# EAGLE design dr_amged (EAGLE 7.7.0)
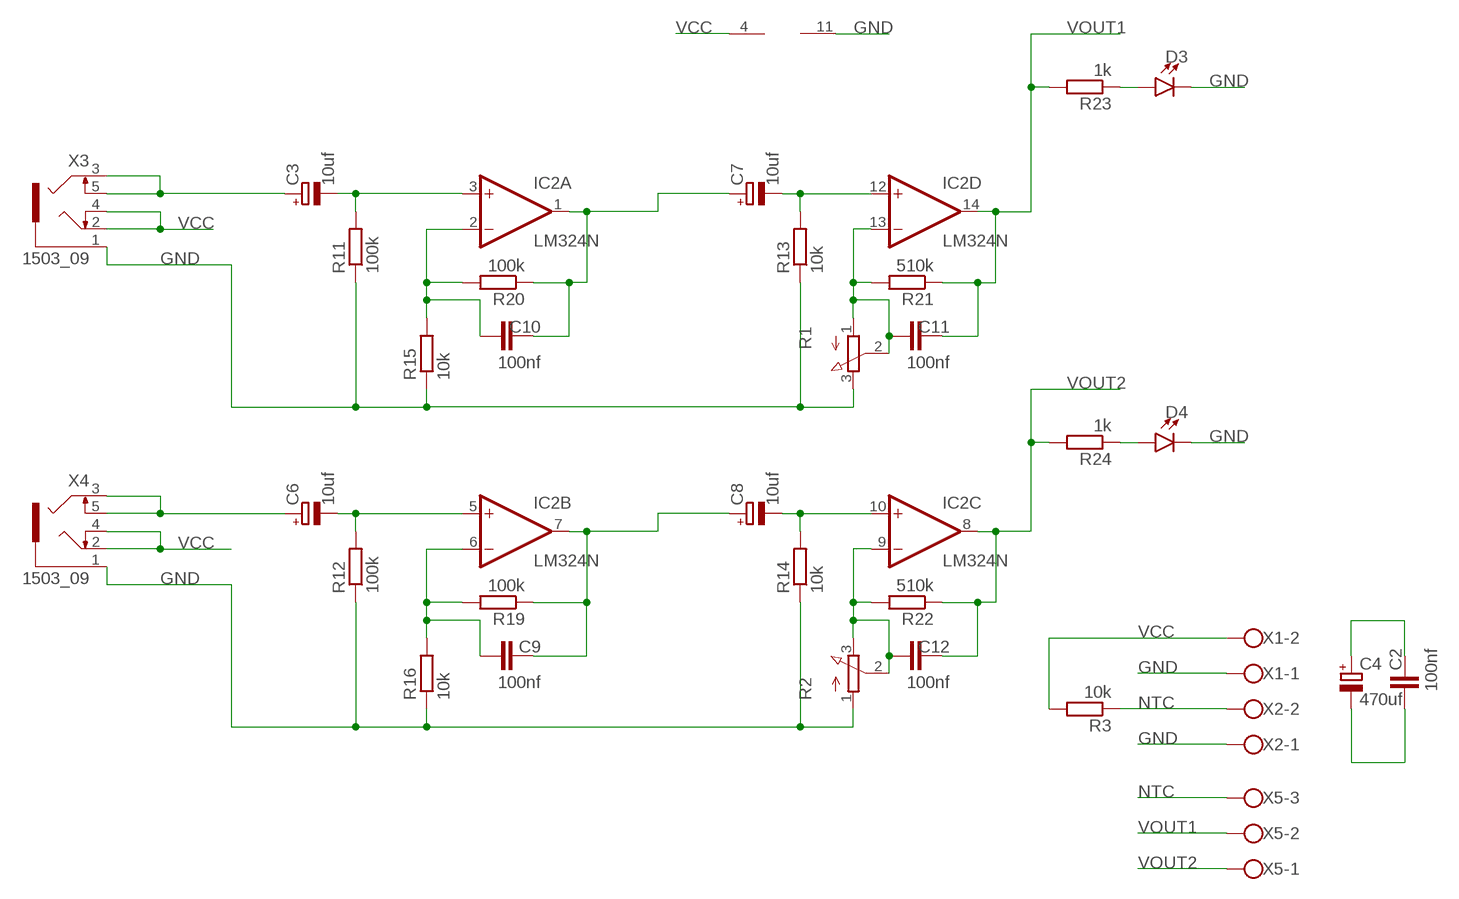
[diagram p0: schematic, sheet 1]

## Parts
C2  100nf  C-EU050-030X075  [C050-030X075]
C3  10uf  CPOL-EUE2-5  [E2-5]
C4  470uf  CPOL-EUE3.5-8  [E3,5-8]
C6  10uf  CPOL-EUE2-5  [E2-5]
C7  10uf  CPOL-EUE2-5  [E2-5]
C8  10uf  CPOL-EUE2-5  [E2-5]
C9  100nf  C-EU050-030X075  [C050-030X075]
C10  100nf  C-EU050-030X075  [C050-030X075]
C11  100nf  C-EU050-030X075  [C050-030X075]
C12  100nf  C-EU050-030X075  [C050-030X075]
D3  LED5MM  [LED_5MM]
D4  LED5MM  [LED_5MM]
IC2  LM324N  [DIL14]
R1  3RP/1610N  [3RP/1610N]
R2  3RP/1610N  [3RP/1610N]
R3  10k  R-EU_0207/10  [0207/10]
R11  100k  R-EU_0207/10  [0207/10]
R12  100k  R-EU_0207/10  [0207/10]
R13  10k  R-EU_0207/10  [0207/10]
R14  10k  R-EU_0207/10  [0207/10]
R15  10k  R-EU_0207/10  [0207/10]
R16  10k  R-EU_0207/10  [0207/10]
R19  100k  R-EU_0207/10  [0207/10]
R20  100k  R-EU_0207/10  [0207/10]
R21  510k  R-EU_0207/10  [0207/10]
R22  510k  R-EU_0207/10  [0207/10]
R23  1k  R-EU_0207/10  [0207/10]
R24  1k  R-EU_0207/10  [0207/10]
X1  W237-102  [W237-102]
X2  W237-102  [W237-102]
X3  1503_09  [1503_09]
X4  1503_09  [1503_09]
X5  W237-103  [W237-103]

## Nets
GND: C2.1 C4.- D3.K(C) D4.K(C) IC2.11(P:V-) R1.3(E) R2.1(A) R11.1 R12.1 R13.1 R14.1 R15.1 R16.1 X1.1 X2.1 X3.1 X4.1
N$4: C8.+ C9.2 IC2.7(B:OUT) R19.1
N$9: C9.1 IC2.6(B:-IN) R16.2 R19.2
N$12: C7.+ C10.2 IC2.1(A:OUT) R20.1
N$13: C10.1 IC2.2(A:-IN) R15.2 R20.2
N$15: C11.1 IC2.13(D:-IN) R1.1(A) R1.2(S) R21.2
N$17: C12.1 IC2.9(C:-IN) R2.2(S) R2.3(E) R22.2
N$18: C6.+ X4.3 X4.5
N$23: C3.+ X3.3 X3.5
N$24: C6.- IC2.5(B:+IN) R12.2
N$26: C7.- IC2.12(D:+IN) R13.2
N$28: C8.- IC2.10(C:+IN) R14.2
N$35: C3.- IC2.3(A:+IN) R11.2
N$36: D3.A R23.1
N$37: D4.A R24.1
NTC: R3.1 X2.2 X5.3
VCC: C2.2 C4.+ IC2.4(P:V+) R3.2 X1.2 X3.2 X3.4 X4.2 X4.4
VOUT1: C11.2 IC2.14(D:OUT) R21.1 R23.2 X5.2
VOUT2: C12.2 IC2.8(C:OUT) R22.1 R24.2 X5.1

## Library data of the parts
C2 C9-C12 = rcl:C-EU: CAPACITOR, European symbol; SPICEPREFIX: C
C3 C4 C6-C8 = rcl:CPOL-EU: POLARIZED CAPACITOR, European symbol; SPICEPREFIX: C
D3 D4 = SparkFun-LED:LED: LED (Generic) Standard schematic elements and footprints for 5mm, 3mm, 1206, and 0603 sized LEDs. Generic LEDs with no color specified.
IC2 = linear:LM324: OP AMP
R1 R2 = pot:3RP/1610N: 16mm Potentiometer one level Source: http://www.alphapotentiometers.net/html/16mm_pot_2.html
R3 R11-R16 R19-R24 = rcl:R-EU_: RESISTOR, European symbol; SPICEPREFIX: R
X1 X2 = con-wago-500:W237-102: WAGO SCREW CLAMP; MPN: 237-102; OC_FARNELL: unknown; OC_NEWARK: 70K9898
X3 X4 = con-lumberg:1503_09: Jack connectors according to JISC 6560, 3.5 mm Klinkeneinbaukupplung nach JISC 6560, 3,5 mm, 3-polig/ stereo, abgewinkelte Ausführung, mit 2 Öffnern und Lötaugen, für Leiterplatten Rückseitenmontage Source: http://www.lumberg.com/Produkte/PDFs/1503_09.pdf; OC_FARNELL: 1243244; OC_NEWARK: unknown
X5 = con-wago-500@1:W237-103: WAGO SCREW CLAMP; MPN: 237-103; OC_FARNELL: unknown; OC_NEWARK: 18M7116

## Board
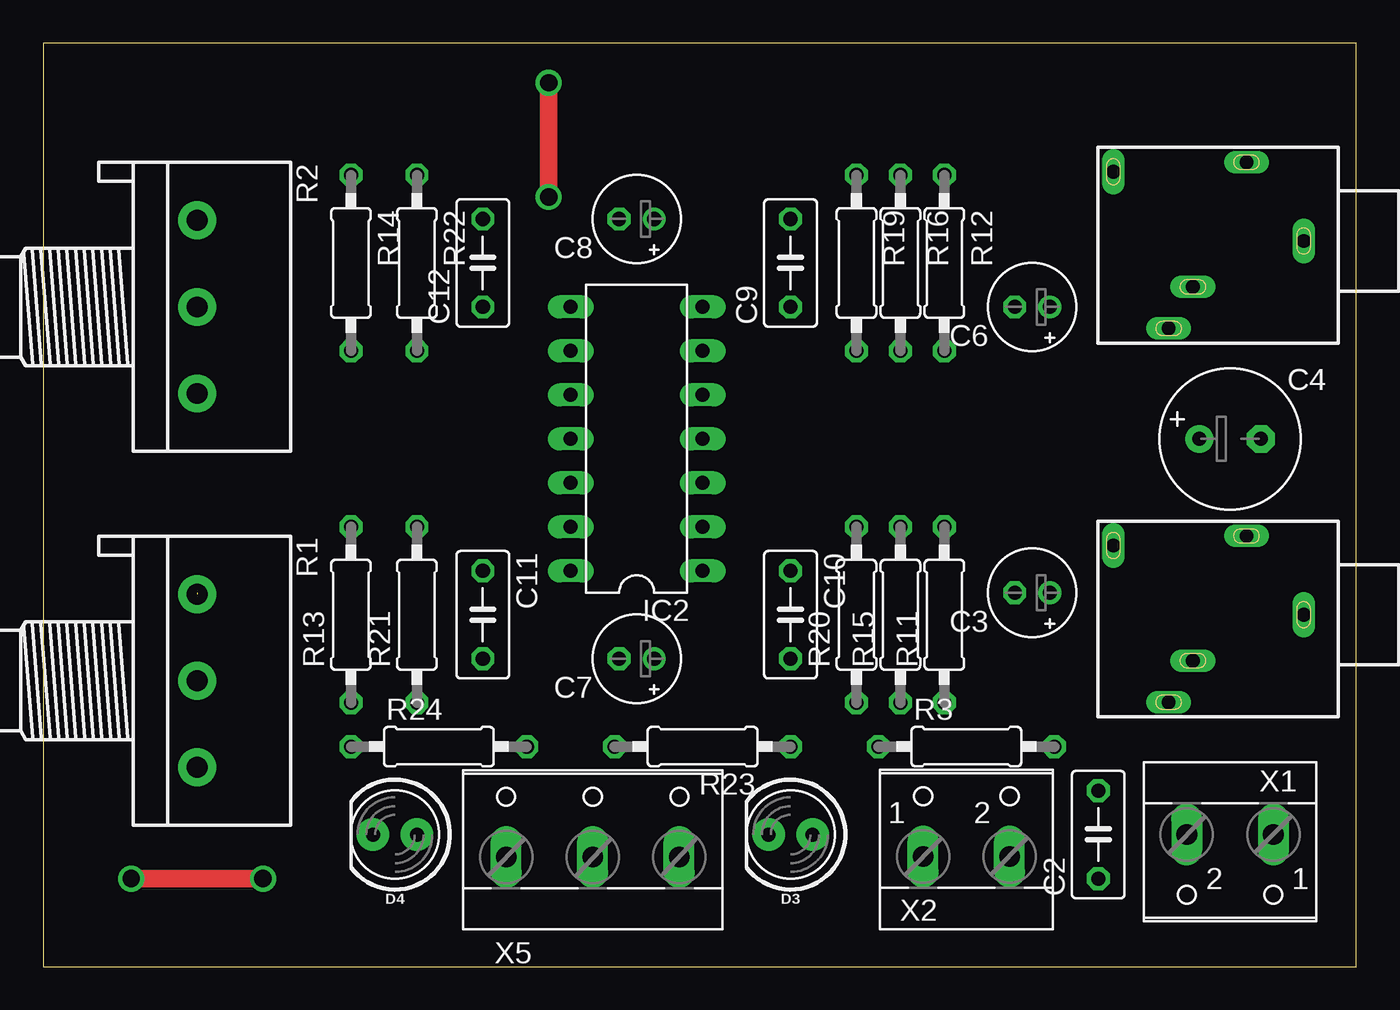
[diagram p1: board, top side]
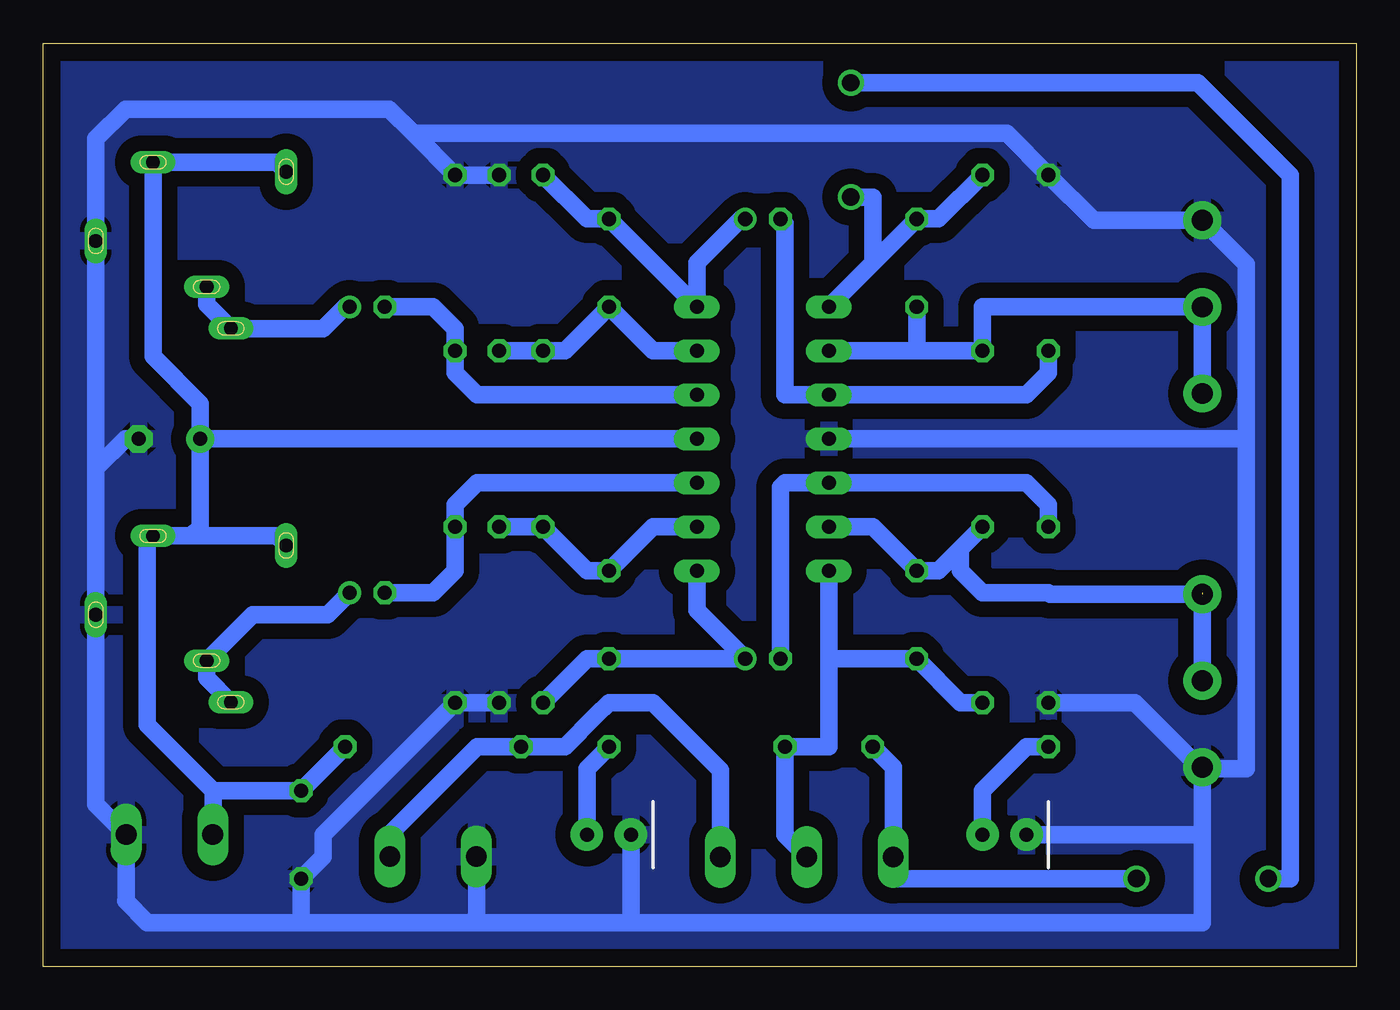
[diagram p2: board, bottom side, seen from below]

Size 75.87 x 53.33 mm. Coordinates in mm from the lower left corner, seen from the top.
Outline: 0,0 75.87,0 75.87,53.33 0,53.33 0,0
Copper layers (1*16): Top 0.035mm / dielectric 1.5mm / Bottom 0.035mm
Design rules "default *": minimum track width 30mil, minimum drill 0.35mm, track to track 35mil, track to pad 35mil, pad to pad 6mil, via to via 6mil, smd to smd 6mil, copper to edge 40mil, drill to drill 6mil, minimum pad ring 10mil, minimum via ring 8mil, stop-mask expansion 4mil, vias tented up to drill 0mil, thermal gap 10mil

### Footprints (pad centres in the part's own frame; a part is rotated, then mirrored left to right if it is on the bottom)
C050-030X075 = drill 0.813 octagon: 1 -2.54,0; 2 2.54,0
E2-5 = drill 0.813 pad 1.27: + -1.016,0 | drill 0.813 pad 1.27 octagon: - 1.016,0
E3,5-8 = drill 0.813 pad 1.6: + -1.778,0 | drill 0.813 pad 1.6 octagon: - 1.778,0
LED_5MM = drill 0.813 pad 1.88: A -1.27,0; K 1.27,0
DIL14 = drill 0.813 long: 1 -7.62,-3.81; 2 -5.08,-3.81; 3 -2.54,-3.81; 4 0,-3.81; 5 2.54,-3.81; 6 5.08,-3.81; 7 7.62,-3.81; 8 7.62,3.81; 9 5.08,3.81; 10 2.54,3.81; 11 0,3.81; 12 -2.54,3.81; 13 -5.08,3.81; 14 -7.62,3.81
3RP/1610N = drill 1.2 pad 2.184: 1 -5,0; 2 0,0; 3 5,0
0207/10 = drill 0.813 octagon: 1 -5.08,0; 2 5.08,0
W237-102 = drill 1.194 long: 1 -2.5,-1.27; 2 2.5,-1.27
1503_09 = drill 0.8 pad 1.2 long: 1 0,-2.1; 2 -4.55,-5.4; 3 5.05,-9.9; 4 -4,-13.1; 5 2.65,-8.5
W237-103 = drill 1.194 long: 1 -5,-1.29; 2 0,-1.29; 3 5,-1.29

### Placement (x,y rotation side)
C2  60.96,7.62 90 top
C3  57.15,21.59 180 top
C4  68.58,30.48 0 top
C6  57.15,38.1 180 top
C7  34.29,17.78 180 top
C8  34.29,43.18 180 top
C9  43.18,40.64 90 top
C10  43.18,20.32 270 top
C11  25.4,20.32 270 top
C12  25.4,40.64 90 top
D3  43.18,7.62 180 top
D4  20.32,7.62 180 top
IC2  34.29,30.48 90 top
R1  8.89,16.51 270 top
R2  8.89,38.1 270 top
R3  53.34,12.7 0 top
R11  52.07,20.32 90 top
R12  52.07,40.64 270 top
R13  17.78,20.32 90 top
R14  17.78,40.64 270 top
R15  49.53,20.32 90 top
R16  49.53,40.64 270 top
R19  46.99,40.64 270 top
R20  46.99,20.32 90 top
R21  21.59,20.32 90 top
R22  21.59,40.64 270 top
R23  38.1,12.7 180 top
R24  22.86,12.7 0 top
X1  68.58,6.35 180 top
X2  53.34,7.62 0 top
X3  74.93,20.32 270 top
X4  74.93,41.91 270 top
X5  31.75,7.62 0 top

### Tracks (layer width: path | path; a pad name or v marks a point on that pad's centre or on a via)
GND
  Bottom 1.016: R15.1 R11.1 59.69,7.62 59.69,6.35 C2.1 60.96,2.54 | 72.83,28.77 X3.1 72.83,9.37 X1.1 71.08,3.85 71.12,3.81 69.85,2.54 60.96,2.54 | 72.83,28.77 71.12,30.48 C4.- | 72.83,28.77 X4.1 72.83,47.82 71.12,49.53 55.88,49.53 54.48,48.13 | 54.48,48.13 R12.1 R16.1 | R14.1 17.7,45.64 | R14.1 15.16,43.1 R2.1 6.35,40.56 6.35,30.48 | IC2.11 6.35,30.48 | 6.35,30.48 6.35,11.43 8.81,11.43 | 8.81,11.43 R1.3 | D4.K 8.89,7.62 | 8.89,7.62 8.89,11.35 | 8.89,11.35 8.81,11.43 | R13.1 12.78,15.24 8.89,11.35 | X2.1 50.84,2.58 | 50.84,2.58 50.8,2.54 41.91,2.54 | D3.K 41.91,2.54 | 60.96,2.54 50.88,2.54 50.84,2.58 | R14.1 20.19,48.13 54.48,48.13 | 8.89,7.62 8.89,2.54 41.91,2.54
  pour Bottom: 0,53.34 76.2,53.34 76.2,1.27 0,1.27
N$4
  Bottom 1.016: R19.1 44.45,43.18 C9.2 IC2.7 38.1,40.64 35.56,43.18 C8.+
N$9
  Bottom 1.016: R16.2 R19.2 45.72,35.56 C9.1 40.64,35.56 IC2.6
N$12
  Bottom 1.016: R20.1 44.45,17.78 C10.2 C7.+ 38.1,20.57 IC2.1
N$13
  Bottom 1.016: R15.2 R20.2 44.45,22.86 C10.1 40.64,25.4 IC2.2
N$15  (1 unrouted)
  Bottom 1.016: 22.86,24.13 24.13,22.86 C11.1 27.94,25.4 IC2.13 | 22.86,24.13 R21.2 | R1.2 8.89,21.59 | R1.1 17.7,21.51 17.78,21.59 21.59,21.59 22.86,22.86 22.86,24.13
N$17
  Bottom 1.016: R2.3 R2.2 21.59,38.1 R22.2 25.4,35.56 | IC2.9 25.4,35.56 | C12.1 25.4,35.56
N$18
  Bottom 1.016: X4.5 66.43,38.26 X4.3 65,36.83 59.69,36.83 58.42,38.1 C6.+
N$23
  Bottom 1.016: X3.3 66.43,16.67 X3.5 63.78,20.32 59.44,20.32 C3.+
N$24
  Bottom 1.016: IC2.5 50.8,33.02 52.07,34.29 R12.2 52.07,36.83 53.34,38.1 C6.-
N$26
  Bottom 1.016: C7.- 33.27,27.69 33.02,27.94 IC2.12 19.05,27.94 17.78,26.67 R13.2
N$28
  Bottom 1.016: C8.- 33.02,42.93 33.02,33.02 IC2.10 19.05,33.02 17.78,34.29 R14.2
N$35
  Bottom 1.016: IC2.3 50.8,27.94 52.07,26.67 R11.2 52.07,22.86 53.34,21.59 C3.-
N$36
  Bottom 1.016: D3.A 44.45,11.43 R23.1
N$37
  Bottom 1.016: R24.1 19.05,12.7 21.59,10.16 D4.A
NTC
  Bottom 1.016: X5.3 36.75,11.35 40.64,15.24 43.18,15.24 43.92,14.5 43.93,14.5 45.73,12.7 R3.1 50.8,12.7 55.88,7.62 55.84,7.58 X2.2
VCC
  Bottom 1.016: R3.2 C2.2 66.04,10.16 | X1.2 66.04,7.66 66.04,10.16 | 66.04,10.16 69.85,13.97 69.85,24.55 X3.2 67.31,24.87 | 67.31,24.87 62.38,24.87 X3.4 | X4.4 62.38,46.46 X4.2 69.53,35.24 66.8,32.51 C4.+ | C4.+ 66.8,25.38 67.31,24.87 | IC2.4 C4.+
VOUT1
  Bottom 1.016: R21.1 22.86,15.24 C11.2 30.48,17.78 | 30.48,17.78 IC2.14 | 30.48,17.78 30.48,12.7 R23.2 33.02,7.6 X5.2
VOUT2  (via drill 1)
  Top 1.016: v29.21,44.45 v29.21,51.05 | v5.08,5.08 v12.7,5.08
  Bottom 1.016: R22.1 24.13,43.18 C12.2 27.94,40.64 | IC2.8 27.94,40.64 | R24.2 26.75,11.51 X5.1 26.75,5.16 26.67,5.08 v12.7,5.08 | 27.94,40.64 27.94,44.45 v29.21,44.45 | v29.21,51.05 9.14,51.05 3.81,45.72 3.81,5.08 v5.08,5.08